# Altium schematic sheet PG14_PS_BK500_BK501.SchDoc
size A4; Author: Hanxiao; Revision: EVAL_A02; SheetNumber: 14; SheetTotal: 17
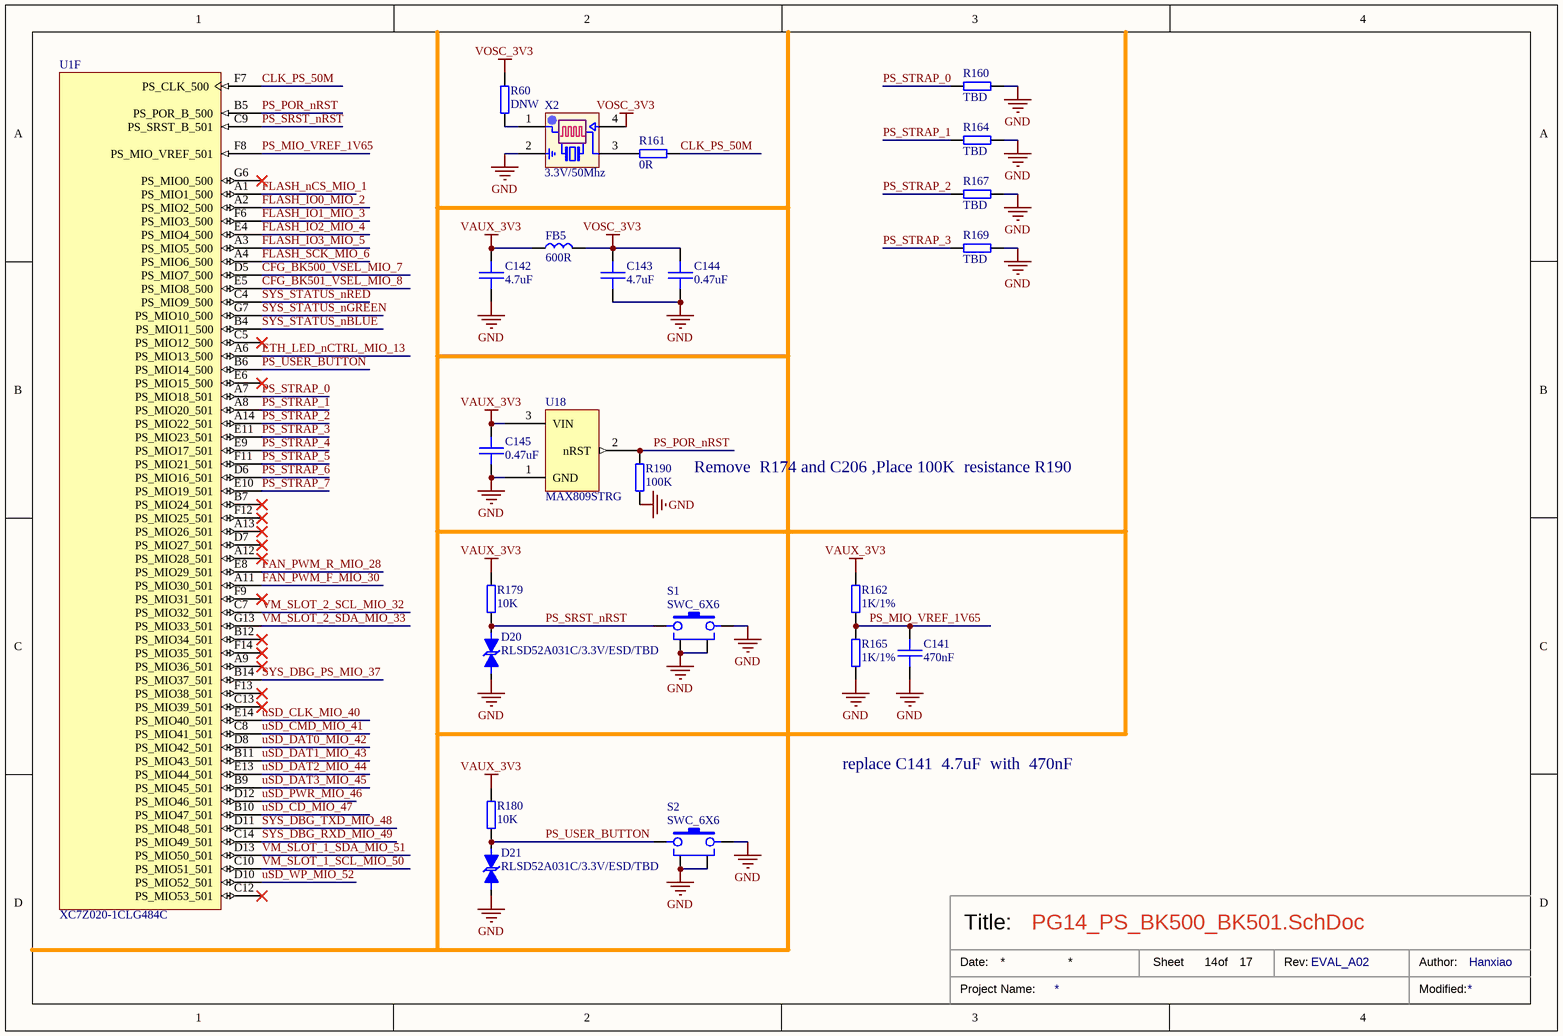
[diagram p0: PG14_PS_BK500_BK501.SchDoc]

## Parts
C141  470nF  [SMT_C_0402]
C142  4.7uF  [SMT_C_0402]
C143  4.7uF  [SMT_C_0402]
C144  0.47uF  [SMT_C_0402]
C145  0.47uF  [SMT_C_0402]
D20  RLSD52A031C/3.3V/ESD/TBD  [SMT_DIODE_SOD_523]
D21  RLSD52A031C/3.3V/ESD/TBD  [SMT_DIODE_SOD_523]
FB5  600R  [SMT_FB_0402]
R60  DNW  [SMT_R_0402]
R160  TBD  [SMT_R_0402]
R161  0R  [SMT_R_0402]
R162  1K/1%  [SMT_R_0402]
R164  TBD  [SMT_R_0402]
R165  1K/1%  [SMT_R_0402]
R167  TBD  [SMT_R_0402]
R169  TBD  [SMT_R_0402]
R179  10K  [SMT_R_0402]
R180  10K  [SMT_R_0402]
R190  100K  [SMT_R_0402]
S1  SWC_6X6  [按键开关-6x6-卧式-直插]
S2  SWC_6X6  [按键开关-6x6-卧式-直插]
U1  XC7Z020-1CLG484C  [XC7Z020_CLG484]  (part F of 10)
U18  MAX809STRG  [SOT95P237X111-3L]
X2  3.3V/50Mhz  [SMT_XTAL_3225]

## Nets
GND: C141.2 C142.2 C143.2 C144.2 C145.2 D20.2(K) D21.2(K) R160.1 R164.1 R165.1 R167.1 R169.1 R190.1 S1.2(PIN2) S1.3 S1.4 S2.2(PIN2) S2.3 S2.4 U18.1(GND) X2.2(GND)
VAUX_3V3: C142.1 C145.1 FB5.2 R162.2 R179.2 R180.2 U18.3(VIN)
VOSC_3V3: C143.1 C144.1 FB5.1 R60.2 X2.4(GND)
CFG_BK500_VSEL_MIO_7: U1.D5(PS_MIO7_500)
CFG_BK501_VSEL_MIO_8: U1.E5(PS_MIO8_500)
CLK_PS_50M: R161.2 U1.F7(PS_CLK_500)
ETH_LED_nCTRL_MIO_13: U1.A6(PS_MIO13_500)
FAN_PWM_F_MIO_30: U1.A11(PS_MIO30_501)
FAN_PWM_R_MIO_28: U1.E8(PS_MIO29_501)
FLASH_IO0_MIO_2: U1.A2(PS_MIO2_500)
FLASH_IO1_MIO_3: U1.F6(PS_MIO3_500)
FLASH_IO2_MIO_4: U1.E4(PS_MIO4_500)
FLASH_IO3_MIO_5: U1.A3(PS_MIO5_500)
FLASH_nCS_MIO_1: U1.A1(PS_MIO1_500)
FLASH_SCK_MIO_6: U1.A4(PS_MIO6_500)
PS_MIO_VREF_1V65: C141.1 R162.1 R165.2 U1.F8(PS_MIO_VREF_501)
PS_POR_nRST: R190.2 U1.B5(PS_POR_B_500) U18.2(nRST)
PS_SRST_nRST: D20.1(A) R179.1 S1.1(PIN1) U1.C9(PS_SRST_B_501)
PS_STRAP_0: R160.2 U1.A7(PS_MIO18_501)
PS_STRAP_1: R164.2 U1.A8(PS_MIO20_501)
PS_STRAP_2: R167.2 U1.A14(PS_MIO22_501)
PS_STRAP_3: R169.2 U1.E11(PS_MIO23_501)
PS_STRAP_4: U1.E9(PS_MIO17_501)
PS_STRAP_5: U1.F11(PS_MIO21_501)
PS_STRAP_6: U1.D6(PS_MIO16_501)
PS_STRAP_7: U1.E10(PS_MIO19_501)
PS_USER_BUTTON: D21.1(A) R180.1 S2.1(PIN1) U1.B6(PS_MIO14_500)
SYS_DBG_PS_MIO_37: U1.B14(PS_MIO37_501)
SYS_DBG_RXD_MIO_49: U1.C14(PS_MIO49_501)
SYS_DBG_TXD_MIO_48: U1.D11(PS_MIO48_501)
SYS_STATUS_nBLUE: U1.B4(PS_MIO11_500)
SYS_STATUS_nGREEN: U1.G7(PS_MIO10_500)
SYS_STATUS_nRED: U1.C4(PS_MIO9_500)
uSD_CD_MIO_47: U1.B10(PS_MIO47_501)
uSD_CLK_MIO_40: U1.E14(PS_MIO40_501)
uSD_CMD_MIO_41: U1.C8(PS_MIO41_501)
uSD_DAT0_MIO_42: U1.D8(PS_MIO42_501)
uSD_DAT1_MIO_43: U1.B11(PS_MIO43_501)
uSD_DAT2_MIO_44: U1.E13(PS_MIO44_501)
uSD_DAT3_MIO_45: U1.B9(PS_MIO45_501)
uSD_PWR_MIO_46: U1.D12(PS_MIO46_501)
uSD_WP_MIO_52: U1.D10(PS_MIO52_501)
VM_SLOT_1_SCL_MIO_50: U1.C10(PS_MIO51_501)
VM_SLOT_1_SDA_MIO_51: U1.D13(PS_MIO50_501)
VM_SLOT_2_SCL_MIO_32: U1.C7(PS_MIO32_501)
VM_SLOT_2_SDA_MIO_33: U1.G13(PS_MIO33_501)
NetR60_1: R60.1 X2.1(OE/NC)
NetR161_1: R161.1 X2.3(CLKO)

Not connected (* = marked no-connect by the designer): U1 A9(PS_MIO36_501)* A12(PS_MIO28_501)* A13(PS_MIO26_501)* B7(PS_MIO24_501)* B12(PS_MIO34_501)* C5(PS_MIO12_500)* C12(PS_MIO53_501)* C13(PS_MIO39_501)* D7(PS_MIO27_501)* E6(PS_MIO15_500)* F9(PS_MIO31_501)* F12(PS_MIO25_501)* F13(PS_MIO38_501)* F14(PS_MIO35_501)* G6(PS_MIO0_500)*

## Notes on the sheet
- Remove  R174 and C206 ,Place 100K  resistance R190
- replace C141  4.7uF  with  470nF
- Date:
- Title:
- Sheet
- of
- Rev:
- Author:
- Project Name:
- Modified:
- Title
- Size:
- A4
- Number:
- Time:
- Revision:
- File:

## Library data of the parts
C141-C145 = SMT_C_0402: Surface mount capacitor 0402
D20 D21 = SMT_DIODE_TVS_B_SOD_523: Surface mount bidirectional TVS diode SOD-523(0603) Package
FB5 = SMT_FB_0603: Surface mount ferrite beads 0603
R60 R160-R162 R164 R165 R167 R169 R179 R180 R190 = SMT_R_0402: Surface mount resistor 0402
S1 S2 = 按键开关-6x6-卧式-直插
U1 = XC7Z020-1CLG484C: 667 MHz Zynq?7000 AP SoC, 130 PS I/O, 200 FPGA I/O, 484-Ball BGA, Speed Grade 1, Commercial Grade, Pb-Free; Manufacturer: Xilinx; Extensible Block RAM (# 36Kb Blocks): 560 KB (140); Flip Flops: 106400; LUTs: 53200; Speed Grade: -1; DatasheetVersion: v1.2; PackageVersion: Rev 1.1; PackageReference: CLG484; PackageDescription: Wire-Bond Chip-Scale BGA, Body 19 x 19 mm, 0.8 mm Pitch; Generic Part Number: XC7Z020; RoHS: Pb-Free; Mounting Technology: Surface Mount; Code_JEDEC: MO-275-PPAA-2; PartNumber: XC7Z020-1CLG484C; ComponentLink1Description: Datasheet; ComponentLink1URL: http://www.xilinx.com/support/documentation/data_sheets/ds190-Zynq-7000-Overview.pdf; ComponentLink2Description: Package Specification; ComponentLink2URL: http://www.xilinx.com/support/documentation/user_guides/ug865-Zynq-7000-Pkg-Pinout.pdf; ComponentLink3Description: DC and AC Switching Characteristics; ComponentLink3URL: http://www.xilinx.com/support/documentation/data_sheets/ds187-XC7Z010-XC7Z020-Data-Sheet.pdf; ComponentLink4Description: Package File; ComponentLink4URL: http://www.xilinx.com/support/packagefiles/z7packages/xc7z020clg484pkg.txt; ComponentLink5Description: Packaging and Pinout; ComponentLink5URL: http://www.xilinx.com/support/documentation/user_guides/ug865-Zynq-7000-Pkg-Pinout.pdf; ComponentLink6Description: PCB and Layout Guide; ComponentLink6URL: http://www.xilinx.com/support/documentation/user_guides/ug483_7Series_PCB.pdf
U18 = MAX809STRG: Very Low Supply Current / 3-Pin Microprocessor / Reset Monitors
X2 = SMT_XTAL_ACTIVE: Oscillator, Active crystal